# Altium schematic sheet dsau-power.SchDoc: dSAU Motherboard - Power
size Letter; Engineer: Christopher J. Woodall; Organization: Boston University EDF/ECE; DocumentNumber: 2; Revision: A; SheetNumber: 2; SheetTotal: 10; EMAIL: cwoodall@bu.edu; TeamName: Team 19; ProjectName: dSAU
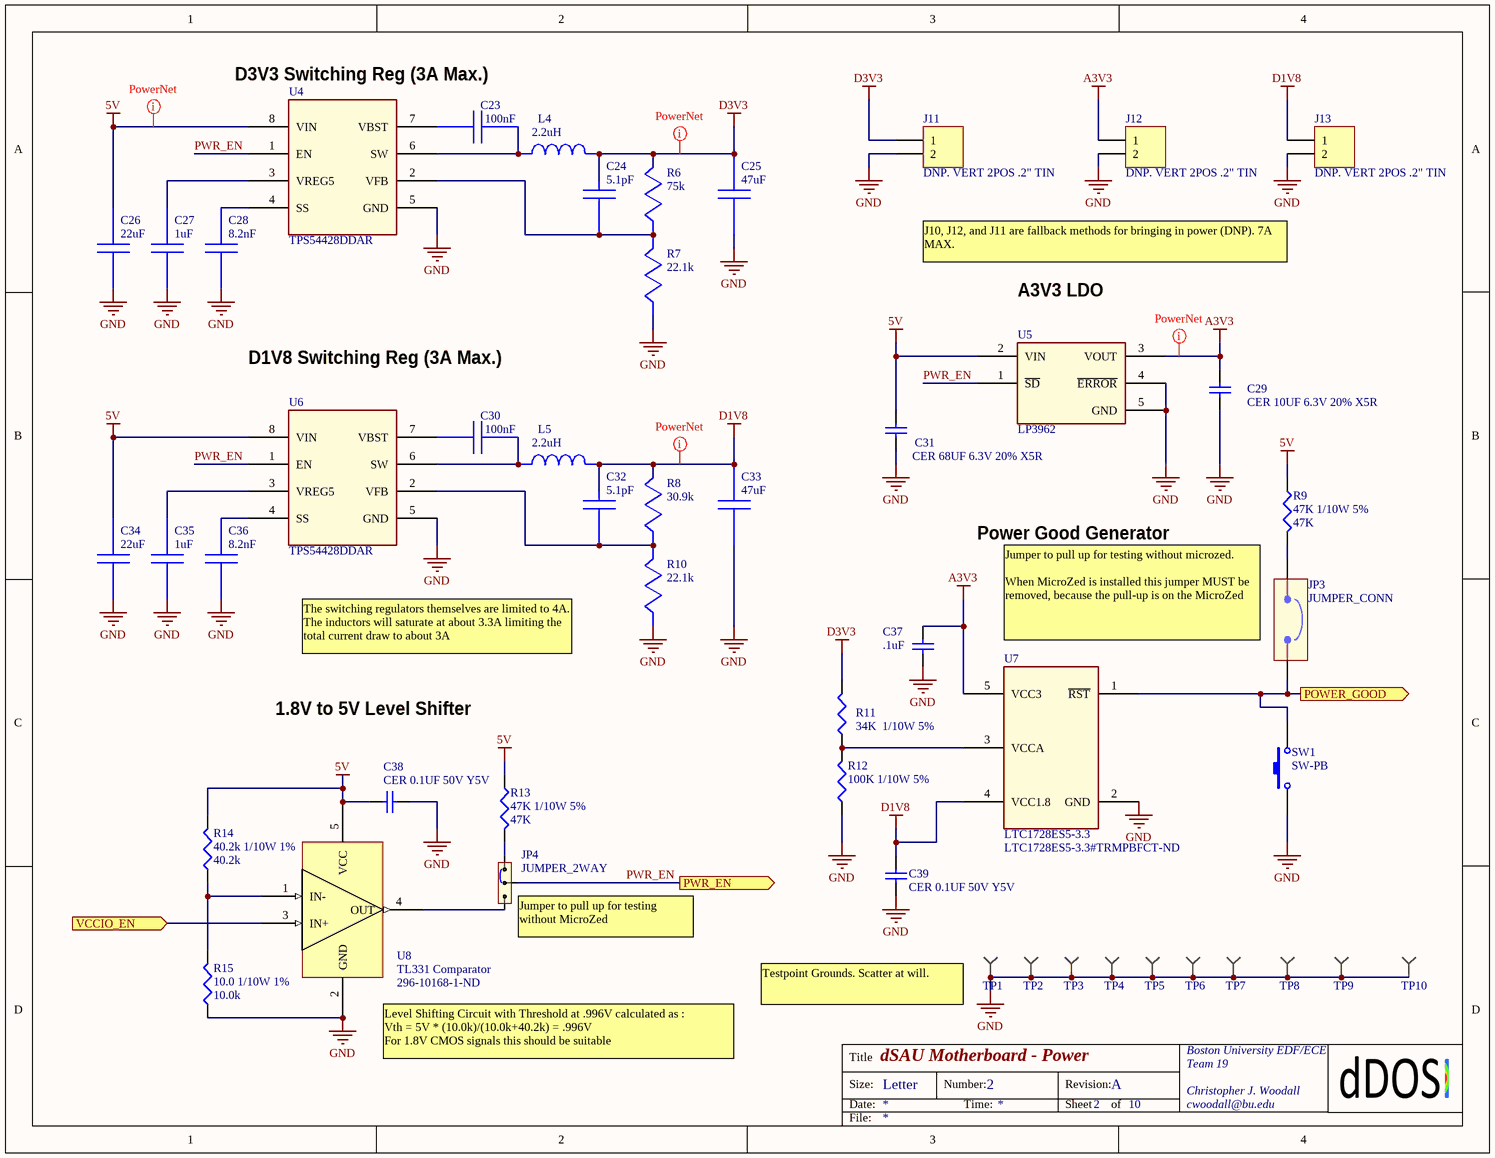
[diagram p0: dsau-power.SchDoc]

## Parts
C23  100nF  [0402]
C24  5.1pF  [0402]
C25  47uF  [1206]
C26  22uF  [1210]
C27  1uF  [0402]
C28  8.2nF  [0402]
C29  CER 10UF 6.3V 20% X5R  [CAPC1608L]
C30  100nF  [0402]
C31  CER 68UF 6.3V 20% X5R  [CAPC3216L]
C32  5.1pF  [0402]
C33  47uF  [1206]
C34  22uF  [1210]
C35  1uF  [0402]
C36  8.2nF  [0402]
C37  value .1uF  [CAPC1608L]  (hidden comment: CER 0.1UF 50V Y5V)
C38  CER 0.1UF 50V Y5V  [CAPC1608L]
C39  CER 0.1UF 50V Y5V  [CAPC1608L]
J11  DNP. VERT 2POS .2" TIN  [MOLEX_2POS_200mil_0010085021]
J12  DNP. VERT 2POS .2" TIN  [MOLEX_2POS_200mil_0010085021]
J13  DNP. VERT 2POS .2" TIN  [MOLEX_2POS_200mil_0010085021]
JP3  JUMPER_CONN  [HDR1X2]
JP4  JUMPER_2WAY  [HDR1X3]
L4  2.2uH  [SRN6045]
L5  2.2uH  [SRN6045]
R6  75k  [0402]
R7  22.1k  [0402]
R8  30.9k  [0402]
R9  47K 1/10W 5%  value 47K  [RESC1608L]
R10  22.1k  [0402]
R11  34K  1/10W 5%  [RESC1608L]
R12  100K 1/10W 5%  [RESC1608L]
R13  47K 1/10W 5%  value 47K  [RESC1608L]
R14  40.2k 1/10W 1%  value 40.2k  [RESC1608L]
R15  10.0 1/10W 1%  value 10.0k  [RESC1608L]
SW1  SW-PB  [SPST_SW_FSM4JH]
TP1  TESTPOINT_CW  [PIN1]  (value not drawn)
TP2  TESTPOINT_CW  [PIN1]  (value not drawn)
TP3  TESTPOINT_CW  [PIN1]  (value not drawn)
TP4  TESTPOINT_CW  [PIN1]  (value not drawn)
TP5  TESTPOINT_CW  [PIN1]  (value not drawn)
TP6  TESTPOINT_CW  [PIN1]  (value not drawn)
TP7  TESTPOINT_CW  [PIN1]  (value not drawn)
TP8  TESTPOINT_CW  [PIN1]  (value not drawn)
TP9  TESTPOINT_CW  [PIN1]  (value not drawn)
TP10  TESTPOINT_CW  [PIN1]  (value not drawn)
U4  TPS54428DDAR  [R-PDSO-G8]
U5  LP3962  [SOT223-5N]
U6  TPS54428DDAR  [R-PDSO-G8]
U7  LTC1728ES5-3.3  Supplier Part Number 1: LTC1728ES5-3.3#TRMPBFCT-ND  [SOT23_5L_CUSTOM]
U8  TL331 Comparator  Supplier Part Number 1: 296-10168-1-ND  [SOT23_5L_CUSTOM]

## Ports
POWER_GOOD (out), PWR_EN (out), VCCIO_EN (in)

## Nets
5V: C26.1 C31.2 C34.1 C38.1 R9.1 R13.1 R14.2 U4.8(VIN) U5.2(VIN) U6.8(VIN) U8.5(VCC)
A3V3: C29.2 C37.1 J12.1 U5.3(VOUT) U7.5(VCC3)
D1V8: C32.1 C33.1 C39.2 J13.1 L5.1 R8.1 U7.4(VCC1.8)
D3V3: C24.1 C25.1 J11.1 L4.1 R6.1 R11.2
GND: C25.2 C26.2 C27.2 C28.2 C29.1 C31.1 C33.2 C34.2 C35.2 C36.2 C37.2 C38.2 C39.1 J11.2 J12.2 J13.2 R7.2 R10.2 R12.1 R15.1 SW1.2 TP1.1 TP2.1 TP3.1 TP4.1 TP5.1 TP6.1 TP7.1 TP8.1 TP9.1 TP10.1 U4.5(GND) U5.4(~{ERROR}) U5.5(GND) U6.5(GND) U7.2(GND) U8.2(GND)
POWER_GOOD: JP3.1 SW1.1 U7.1(~{RST}) ; port POWER_GOOD
PWR_EN: JP4.2 U4.1(EN) U5.1(~{SD}) U6.1(EN) ; port PWR_EN
VCCIO_EN: U8.3(IN+) ; port VCCIO_EN
NetC23_1: C23.1 U4.7(VBST)
NetC23_2: C23.2 L4.2 U4.6(SW)
NetC24_2: C24.2 R6.2 R7.1 U4.2(VFB)
NetC27_1: C27.1 U4.3(VREG5)
NetC28_1: C28.1 U4.4(SS)
NetC30_1: C30.1 U6.7(VBST)
NetC30_2: C30.2 L5.2 U6.6(SW)
NetC32_2: C32.2 R8.2 R10.1 U6.2(VFB)
NetC35_1: C35.1 U6.3(VREG5)
NetC36_1: C36.1 U6.4(SS)
NetJP3_2: JP3.2 R9.2
NetJP4_1: JP4.1 R13.2
NetJP4_3: JP4.3 U8.4(OUT)
NetR11_1: R11.1 R12.2 U7.3(VCCA)
NetR14_1: R14.1 R15.2 U8.1(IN-)

## Layout directives
net class PowerNet: 5V, A3V3, D1V8, D3V3

## Notes on the sheet
- D3V3 Switching Reg (3A Max.)
- J10, J12, and J11 are fallback methods for bringing in power (DNP). 7A MAX.
- A3V3 LDO
- D1V8 Switching Reg (3A Max.)
- Power Good Generator
- Jumper to pull up for testing without microzed.
  When MicroZed is installed this jumper MUST be removed, because the pull-up is on the MicroZed
- The switching regulators themselves are limited to 4A. The inductors will saturate at about 3.3A limiting the total current draw to about 3A
- 1.8V to 5V Level Shifter
- (near JP4) Jumper to pull up for testing without MicroZed
- (near TP1) Testpoint Grounds. Scatter at will.
- (near U8) Level Shifting Circuit with Threshold at .996V calculated as :
  Vth = 5V * (10.0k)/(10.0k+40.2k) = .996V
  For 1.8V CMOS signals this should be suitable
- Title
- Size:
- Date:
- Letter
- Number:
- Time:
- Revision:
- Sheet
- of
- File:

## Library data of the parts
C23 C30 = C1005X5R1A104K: Manufacturer Name: TDK; PackageReference: C1005X5R1A104K; Manufacturer Part Number: C1005X5R1A104K; Value: 100nF; Supplier 1: Digi-Key; Supplier Part Number 1: 445-1265-1-ND
C24 C32 = GRM1555C1E5R1CA01D: GRM1555C1E5R1CA0; Manufacturer Part Number: C0402C519C5GACTU; Manufacturer Name: MuRata; PackageReference: C0402C519C5GACTU; Value: 5.1pF; Supplier 1: Digi-Key; Supplier Part Number 1: 399-8972-1-ND
C25 C33 = GRM31CR60J476ME19L: GRM31CR60J476ME1; Manufacturer Name: MuRata; PackageReference: GRM31CR60J476ME19L; Manufacturer Part Number: GRM31CR60J476ME19L; Value: 47uF; Supplier 1: Digi-Key; Supplier Part Number 1: 490-3907-1-ND
C26 C34 = C3225X5R1A226M: Manufacturer Name: TDK; PackageReference: C3225X5R1A226M; Manufacturer Part Number: C3225X5R1A226M; Value: 22uF; Supplier 1: Digi-Key; Supplier Part Number 1: 445-1403-1-ND
C27 C35 = GRM155R61A105KE15D: GRM155R61A105KE1; Manufacturer Name: MuRata; PackageReference: GRM155R61A105KE15D; Manufacturer Part Number: GRM155R61A105KE15D; Value: 1uF; Supplier 1: Digi-Key; Supplier Part Number 1: 490-3890-1-ND
C28 C36 = GRM155R71E822KA01D: GRM155R71E822KA0; Manufacturer Name: MuRata; PackageReference: GRM155R71E822KA01D; Manufacturer Part Number: GRM155R71E822KA01D; Value: 8.2nF; Supplier 1: Digi-Key; Supplier Part Number 1: 490-1311-1-ND
C29 = Cap: Capacitor; Manufacturer: Samsung Electro-Mechanics America, Inc; Manufacturer Part Number: CL10A106MQ8NNNC; Published: 8-Jun-2000; LatestRevisionDate: 17-Jul-2002; LatestRevisionNote: Re-released for DXP Platform.; PackageReference: RAD-0.3; Publisher: Altium Limited; Value: 10uF; Supplier 1: Digi-Key; Supplier Part Number 1: 1276-1119-1-ND
C31 = Cap: Capacitor; Manufacturer: TDK Corporation; Manufacturer Part Number: C3216X5R0J686M160AB; Published: 8-Jun-2000; LatestRevisionDate: 17-Jul-2002; LatestRevisionNote: Re-released for DXP Platform.; PackageReference: C1206; Publisher: Altium Limited; Value: 68uF; Supplier 1: Digi-Key; Supplier Part Number 1: 445-14671-1-ND
C37 = Cap: Capacitor; Manufacturer: Yageo; Manufacturer Part Number: CC0603ZRY5V9BB104; Published: 8-Jun-2000; LatestRevisionDate: 17-Jul-2002; LatestRevisionNote: Re-released for DXP Platform.; PackageReference: RAD-0.3; Publisher: Altium Limited; Supplier 1: Digi-Key; Supplier Part Number 1: 311-1343-1-ND
C38 C39 = Cap: Capacitor; Manufacturer: Yageo; Manufacturer Part Number: CC0603ZRY5V9BB104; Value: .1uF; Published: 8-Jun-2000; LatestRevisionDate: 17-Jul-2002; LatestRevisionNote: Re-released for DXP Platform.; PackageReference: RAD-0.3; Publisher: Altium Limited; Supplier 1: Digi-Key; Supplier Part Number 1: 311-1343-1-ND
J11-J13 = Header 2: Header, 2-Pin; Manufacturer: Molex Inc; Manufacturer Part Number: 0010085021; LatestRevisionDate: 17-Jul-2002; LatestRevisionNote: Re-released for DXP Platform.; Publisher: Altium Limited; Supplier 1: Digi-Key; Supplier Part Number 1: WM4333-ND
L4 L5 = SRN6045-2R2Y: Manufacturer Name: Bourns; PackageReference: SRN6045-2R2Y; Manufacturer Part Number: SRN6045-2R2Y; Value: 2.2uH; Supplier 1: Digi-Key; Supplier Part Number 1: SRN6045-2R2YCT-ND
R6 = CRCW040275K0FKED: Manufacturer Name: Vishay-Dale; PackageReference: CRCW040275K0FKED; Manufacturer Part Number: CRCW040275K0FKED; Value: 75k; Supplier 1: Digi-Key; Supplier Part Number 1: 541-75.0KLCT-ND
R7 R10 = CRCW040222K1FKED: Manufacturer Name: Vishay-Dale; PackageReference: CRCW040222K1FKED; Manufacturer Part Number: CRCW040222K1FKED; Value: 22.1k; Supplier 1: Digi-Key; Supplier Part Number 1: 541-22.1KLCT-ND
R8 = CRCW040275K0FKED: CRCW040230K9FKED; Manufacturer Name: Vishay-Dale; PackageReference: CRCW040230K9FKED; Manufacturer Part Number: CRCW040230K9FKED; Value: 30.9k; Supplier 1: Digi-Key; Supplier Part Number 1: 541-30.9KLCT-ND
R9 R13 = Res3: Resistor; Manufacturer: Yageo; Manufacturer Part Number: 311-47kGRCT-ND; Published: 8-Jun-2000; LatestRevisionDate: 29-May-2009; LatestRevisionNote: IPC-7351 Footprint Added.; PackageReference: J1-0603; Publisher: Altium Limited; PackageDescription: Chip Resistor; Supplier 1: Digi-Key; Supplier Part Number 1: 311-47KGRTR-ND
R11 = Res3: Resistor; Manufacturer: Yageo; Manufacturer Part Number: RT0603DRD0734KL; Published: 8-Jun-2000; LatestRevisionDate: 29-May-2009; LatestRevisionNote: IPC-7351 Footprint Added.; PackageReference: J1-0603; Publisher: Altium Limited; PackageDescription: Chip Resistor; Value: 34K; Supplier 1: Digi-Key; Supplier Part Number 1: 311-34KDCT-ND
R12 = Res3: Resistor; Manufacturer: Yageo; Manufacturer Part Number: RC0603JR-07100KL; Published: 8-Jun-2000; LatestRevisionDate: 29-May-2009; LatestRevisionNote: IPC-7351 Footprint Added.; PackageReference: J1-0603; Publisher: Altium Limited; PackageDescription: Chip Resistor; Value: 100K; Supplier 1: Digi-Key; Supplier Part Number 1: 311-100KGRCT-ND
R14 = Res3: Resistor; Manufacturer: Yageo; Manufacturer Part Number: RC0603FR-0740K2L; Published: 8-Jun-2000; LatestRevisionDate: 29-May-2009; LatestRevisionNote: IPC-7351 Footprint Added.; PackageReference: J1-0603; Publisher: Altium Limited; PackageDescription: Chip Resistor; Supplier 1: Digi-Key; Supplier Part Number 1: 311-40.2KHRCT-ND
R15 = Res3: Resistor; Manufacturer: Yageo; Manufacturer Part Number: RC0603FR-07220RL; Published: 8-Jun-2000; LatestRevisionDate: 29-May-2009; LatestRevisionNote: IPC-7351 Footprint Added.; PackageReference: J1-0603; Publisher: Altium Limited; PackageDescription: Chip Resistor; Supplier 1: Digi-Key; Supplier Part Number 1: 311-220HRCT-ND
SW1 = SW-PB: Switch; Manufacturer: TE Connectivity; Manufacturer Part Number: FSM4JH; Published: 24-Mar-1999; LatestRevisionDate: 17-Jul-2002; LatestRevisionNote: Re-released for DXP Platform.; PackageReference: SPST-2; Publisher: Altium Limited; Supplier 1: Digi-Key; Supplier Part Number 1: 450-1650-ND
TP1-TP10 = TESTPOINT_CW: Manufacturer: Keystone; Manufacturer Part Number: 5000; Supplier 1: Digi-Key; Supplier Part Number 1: 5000K-ND
U4 U6 = TPS54428DDAR: Imported; Frequency: 700000.0; Imax: 4.0; Vendor: Texas Instruments; Datasheet URL: http://www.ti.com/product/tps54428; Package: R-PDSO-G8; Mktg_Package: R-PDSO-G8; NSID: TPS54428DDAR; Manufacturer_Part_Number: TPS54428DDAR; Manufacturer_Name: Texas Instruments; RefDes: RefDes; Type: DEV; Value: Value; Manufacturer: Texas Instruments; Manufacturer Part Number: TPS54428DDAR; Supplier 1: Digi-key; Supplier Part Number 1: 296-30034-1-ND
U5 = LP3962: Manufacturer: Texas Instruments; Manufacturer Part Number: LP3962EMP-3.3/NOPB; Supplier 1: Digi-Key; Supplier Part Number 1: LP3962EMP-3.3/NOPBCT-ND
U7 = LTC1728ES5-3.3: Manufacturer: Linear Technology; Manufacturer Part Number: LTC1728ES5-3.3#TRMPBF; Supplier 1: Digi-Key
U8 = TL331: Manufacturer Part Number: TL331IDBVR; Manufacturer: Texas Instruments; Supplier 1: Digi-Key